# Altium project First_PCB_dip.PrjPcb
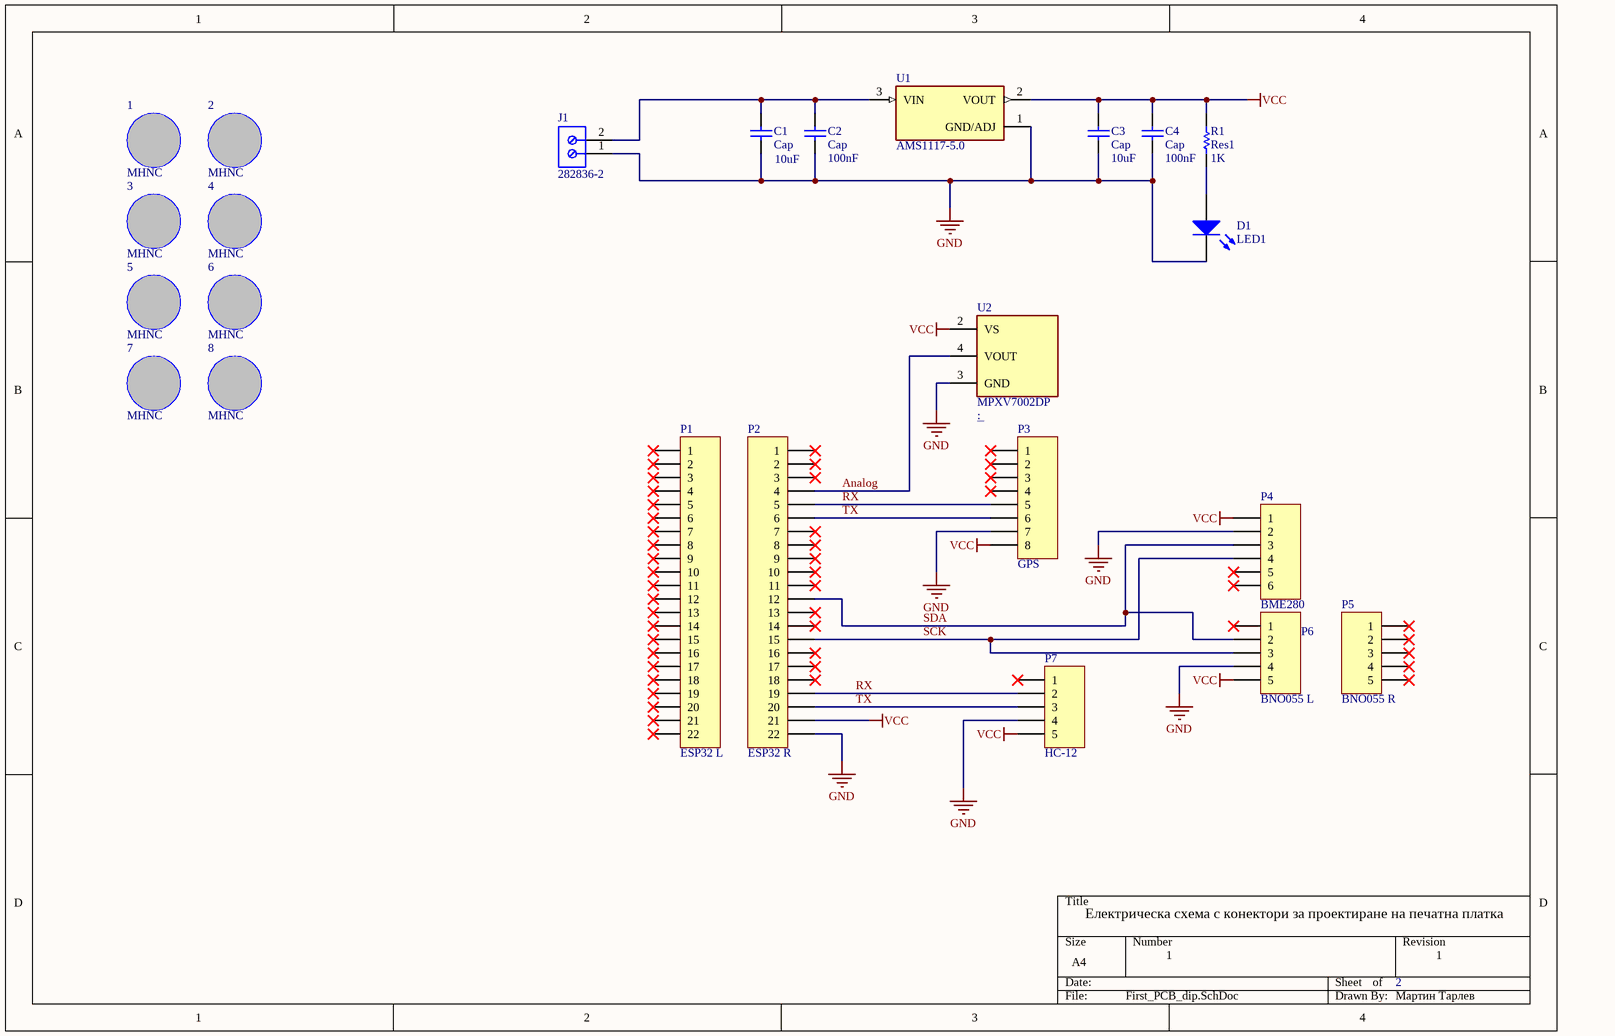
[diagram p0: First_PCB_dip.SchDoc]
2 sheets, 38 parts. Net scope: global (net labels, ports and power ports of the same name join across sheets).
Board file: First_PCB_dip.PcbDoc
Sheets:
  First_PCB_dip.SchDoc
  EL_SCH.SchDoc

## Sheet First_PCB_dip.SchDoc
size A4; SheetNumber: 1; SheetTotal: 2; SPICEModelCacheXDTSTVIX: <root> / <DocumentId>XDTSTVIX</DocumentId> / <CacheFrame Number="0"> / <Model Name="cap" Kind="MDL"> / <Text>*Default semiconductor capacitor / .MODEL CAP C()</Text> / </Model> / <Model Name="led1" Kind="MDL"> / <Text>*Typ RED GaAs LED: Vf=1.7V Vr=4V If=40mA trr=3uS / *LED Pinout: 1=A, 2=K / .MODEL LED1 D (IS=93.2P RS=42M N=3.73 BV=4 IBV=10U / + CJO=2.97P VJ=.75 M=.333 TT=4.32U)</Text> / </Model> / </CacheFrame> / </root>

### Parts
1  MHNC  [MHNC]
2  MHNC  [MHNC]
3  MHNC  [MHNC]
4  MHNC  [MHNC]
5  MHNC  [MHNC]
6  MHNC  [MHNC]
7  MHNC  [MHNC]
8  MHNC  [MHNC]
C1  Cap  value 10uF  [CAP2]
C2  Cap  value 100nF  [CON]
C3  Cap  value 10uF  [CAP2]
C4  Cap  value 100nF  [CON]
D1  LED1  [LED-1]
J1  282836-2  [TECO-282836-2_V]
P1  ESP32 L  [HDR1X22]
P2  ESP32 R  [HDR1X22]
P3  GPS  [HDR1X8]
P4  BME280  [HDR1X6]
P5  BNO055 R  [HDR1X5]
P6  BNO055 L  [HDR1X5]
P7  HC-12  [HDR1X5]
R1  Res1  value 1K  [AXIAL-0.3]
U1  AMS1117-5.0  [SOT229P700X180-4N]
U2  MPXV7002DP  [XDCR_MPXV7002DP]

### Nets
GND: C1.1 C2.1 C3.1 C4.1 D1.2(K) J1.1 P2.22 P3.7 P4.2 P6.4 P7.4 U1.1(GND/ADJ) U2.3(GND)
VCC: C3.2 C4.2 P2.21 P3.8 P4.1 P6.5 P7.5 R1.2 U1.2(VOUT) U2.2(VS)
Analog: P2.4 U2.4(VOUT)
RX: P2.5 P2.19 P3.5 P7.2
SCK: P2.15 P4.4 P6.3
SDA: P2.12 P4.3 P6.2
TX: P2.6 P2.20 P3.6 P7.3
NetC1_2: C1.2 C2.2 J1.2 U1.3(VIN)
NetD1_1: D1.1(A) R1.1

Not connected (* = marked no-connect by the designer): P1 1* 2* 3* 4* 5* 6* 7* 8* 9* 10* 11* 12* 13* 14* 15* 16* 17* 18* 19* 20* 21* 22*; P2 1* 2* 3* 7* 8* 9* 10* 11* 13* 14* 16* 17* 18*; P3 1* 2* 3* 4*; P4 5* 6*; P5 1* 2* 3* 4* 5*; P6 1*; P7 1*

### Notes on the sheet
- Електрическа схема с конектори за проектиране на печатна платка
- 1
- 2
- Мартин Тарлев

### Library data of the parts
C1-C4 = Cap: Capacitor; Published: 8-Jun-2000; LatestRevisionDate: 17-Jul-2002; LatestRevisionNote: Re-released for DXP Platform.; PackageReference: RAD-0.3; Publisher: Altium Limited; PackageDescription: Radial Cap, Thru-Hole; 2 Leads; 0.3 in Pin Spacing
D1 = LED1: Typical RED GaAs LED; Published: 8-Jun-2000; LatestRevisionDate: 08-Jul-2005; LatestRevisionNote: Mech Layer 1 removed.; PackageReference: LED-1; Publisher: Altium Limited; PackageDescription: LED; 2 Leads
J1 = CMP-1684-00017-1: Female Header, Pitch 5 mm, 1 x 2 Position, Height 10 mm, Tail Length 3.5 mm, Rohs, Bulk; Manufacturer: TE Connectivity; Wire Gauge: 16-30AWG; Product Training Modules: Wire-to-BoardEurostyleTerminalBlocks; Clamp Material - Plating: Brass-NickelPlated; Voltage: 300V; Mating Orientation: HorizontalwithBoard; Current: 13.5A; Pitch: 0.197"(5.00mm); Screw Thread: M3; 3D Model: 282836-2.pdf; Other Names: 5ULV-02B / A98076; Dynamic Catalog: BuchananSeries; Number of Levels: 1; Torque - Screw: 0.68Nm(6Lb-In); Featured Product: EurostyleTerminalBlockConnectors; Positions Per Level: 2; Wire Termination: Screw-RisingCageClamp; Datasheet URL: http://www.te.com.cn/commerce/DocumentDelivery/DDEController?Action=showdoc&DocId=Catalog+Section%7F1308389_EUROSTYLE_TERMINAL_BLOCKS%7F0607%7Fpdf%7FEnglish%7FENG_CS_1308389_EUROSTYLE_TERMINAL_BLOCKS_0607.pdf%7F282836-2; Color: Green; Family: TerminalBlocks-WiretoBoard; RoHS Information: 282836-2StatementofCompliance; Standard Package: 300; Contact Material - Plating: Brass-TinPlated; Manufacturer URL: http://www.te.com; Housing Material: Polyamide(PA66),Nylon6/6; Features: Interlocking(Side); Package Description: Female Header, Pitch 5 mm, 1 x 2 Position, Height 10 mm, Tail Length 3.5 mm; Mounting Type: ThroughHole; Package Reference: THD; Packaging: Bulk; Series: Buchanan; Category: Connectors,Interconnects; Screw Material - Plating: Brass-NickelPlated
P1 P2 = Header 22: Header, 22-Pin; LatestRevisionDate: 17-Jul-2002; LatestRevisionNote: Re-released for DXP Platform.
  P1: Publisher: p
  P2: Publisher: Altium Limited
P3 = Header 8: Header, 8-Pin; LatestRevisionDate: 17-Jul-2002; LatestRevisionNote: Re-released for DXP Platform.; Publisher: Altium Limited
P4 = Header 6: Header, 6-Pin; LatestRevisionDate: 17-Jul-2002; LatestRevisionNote: Re-released for DXP Platform.; Publisher: Altium Limited
P5-P7 = Header 5: Header, 5-Pin; LatestRevisionDate: 17-Jul-2002; LatestRevisionNote: Re-released for DXP Platform.; Publisher: Altium Limited
R1 = Res1: Resistor; Published: 8-Jun-2000; LatestRevisionDate: 17-Jul-2002; LatestRevisionNote: Re-released for DXP Platform.; PackageReference: AXIAL-0.3; Publisher: Altium Limited; PackageDescription: Axial Device, Thru-Hole; 2 Leads; 0.3 in Pin Spacing
U1 = AMS1117-5.0: 1A LOW DROPOUT VOLTAGE REGULATOR; MF: ams; MP: AMS1117-5.0; Package: SOT-223 Seeed Technology; SnapEDA_Link: https://www.snapeda.com/parts/AMS1117-5.0/ams/view-part/?ref=snap; Check_prices: https://www.snapeda.com/parts/AMS1117-5.0/ams/view-part/?ref=eda; Availability: Not in stock; Value: *; Price: None
U2 = MPXV7002DP: Pressure Sensor Â±0.29PSI (Â±2kPa) Differential Male - 0.13 (3.3mm) Tube, Dual 0.5 V ~ 4.5 V 8-BSOP (0.475, 12.06mm Width) Dual Ports, Same Side; MF: NXP USA; Availability: Unavailable; SnapEDA_Link: https://www.snapeda.com/parts/MPXV7002DP/NXP%20USA%20Inc./view-part/490173/?ref=snap; MP: MPXV7002DP; Price: None; Package: - NXP USA; Value: *

## Sheet EL_SCH.SchDoc
size A4; SheetNumber: 2; SheetTotal: 2; SPICEModelCacheLZFWWSBS: <root> / <DocumentId>LZFWWSBS</DocumentId> / <CacheFrame Number="0"> / <Model Name="cap" Kind="MDL"> / <Text>*Default semiconductor capacitor / .MODEL CAP C()</Text> / </Model> / <Model Name="led1" Kind="MDL"> / <Text>*Typ RED GaAs LED: Vf=1.7V Vr=4V If=40mA trr=3uS / *LED Pinout: 1=A, 2=K / .MODEL LED1 D (IS=93.2P RS=42M N=3.73 BV=4 IBV=10U / + CJO=2.97P VJ=.75 M=.333 TT=4.32U)</Text> / </Model> / </CacheFrame> / </root>
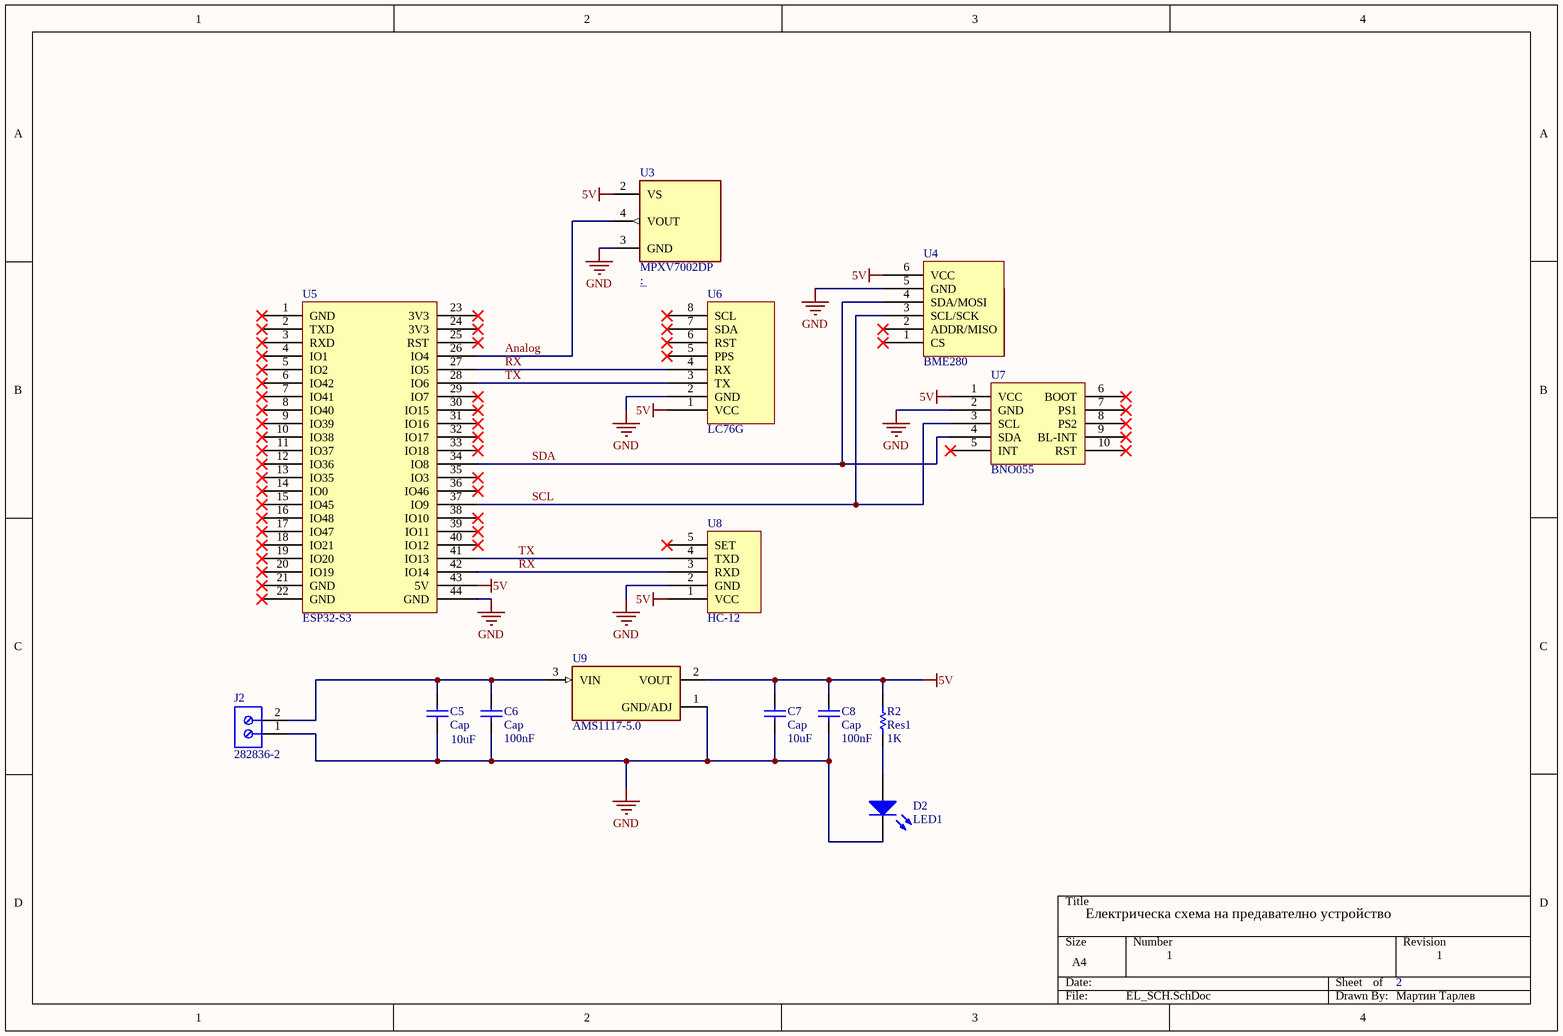
[diagram p1: EL_SCH.SchDoc]

### Parts
C5  Cap  value 10uF  [CAP2]
C6  Cap  value 100nF  [CON]
C7  Cap  value 10uF  [CAP2]
C8  Cap  value 100nF  [CON]
D2  LED1  [LED-1]
J2  282836-2  [TECO-282836-2_V]
R2  Res1  value 1K  [AXIAL-0.3]
U3  MPXV7002DP  [XDCR_MPXV7002DP]
U4  BME280
U5  ESP32-S3
U6  LC76G
U7  BNO055
U8  HC-12
U9  AMS1117-5.0  [SOT229P700X180-4N]

### Nets
5V: C7.2 C8.2 R2.2 U3.2(VS) U4.6(VCC) U5.43(5V) U6.1(VCC) U7.1(VCC) U8.1(VCC) U9.2(VOUT)
GND: C5.1 C6.1 C7.1 C8.1 D2.2(K) J2.1 U3.3(GND) U4.5(GND) U5.44(GND) U6.2(GND) U7.2(GND) U8.2(GND) U9.1(GND/ADJ)
Analog: U3.4(VOUT) U5.26(IO4)
RX: U5.27(IO5) U5.42(IO14) U6.4(RX) U8.3(RXD)
SCL: U4.3(SCL/SCK) U5.37(IO9) U7.3(SCL)
SDA: U4.4(SDA/MOSI) U5.34(IO8) U7.4(SDA)
TX: U5.28(IO6) U5.41(IO13) U6.3(TX) U8.4(TXD)
NetC5_2: C5.2 C6.2 J2.2 U9.3(VIN)
NetD2_1: D2.1(A) R2.1

Not connected (* = marked no-connect by the designer): U4 1(CS)* 2(ADDR/MISO)*; U5 1(GND)* 2(TXD)* 3(RXD)* 4(IO1)* 5(IO2)* 6(IO42)* 7(IO41)* 8(IO40)* 9(IO39)* 10(IO38)* 11(IO37)* 12(IO36)* 13(IO35)* 14(IO0)* 15(IO45)* 16(IO48)* 17(IO47)* 18(IO21)* 19(IO20)* 20(IO19)* 21(GND)* 22(GND)* 23(3V3)* 24(3V3)* 25(RST)* 29(IO7)* 30(IO15)* 31(IO16)* 32(IO17)* 33(IO18)* 35(IO3)* 36(IO46)* 38(IO10)* 39(IO11)* 40(IO12)*; U6 5(PPS)* 6(RST)* 7(SDA)* 8(SCL)*; U7 5(INT)* 6(BOOT)* 7(PS1)* 8(PS2)* 9(BL-INT)* 10(RST)*; U8 5(SET)*

### Notes on the sheet
- Електрическа схема на предавателно устройство
- 1
- 2
- Мартин Тарлев

### Library data of the parts
C5-C8 = Cap: Capacitor; Published: 8-Jun-2000; LatestRevisionDate: 17-Jul-2002; LatestRevisionNote: Re-released for DXP Platform.; PackageReference: RAD-0.3; Publisher: Altium Limited; PackageDescription: Radial Cap, Thru-Hole; 2 Leads; 0.3 in Pin Spacing
D2 = LED1: Typical RED GaAs LED; Published: 8-Jun-2000; LatestRevisionDate: 08-Jul-2005; LatestRevisionNote: Mech Layer 1 removed.; PackageReference: LED-1; Publisher: Altium Limited; PackageDescription: LED; 2 Leads
J2 = CMP-1684-00017-1: as J1 on sheet First_PCB_dip; Datasheet URL: http://www.te.com.cn/commerce/DocumentDelivery/DDEController?Action=showdoc&DocId=Catalog+Section%7F1308389_EUROSTYLE_TERMINAL_BLOCKS%7F0607%7Fpdf%7FEnglish%7FENG_CS_1308389_EUROSTYLE_TERMINAL_BLOCKS_0607.pdf%7F282836-2; Color: Green; Family: TerminalBlocks-WiretoBoard; RoHS Information: 282836-2StatementofCompliance; Standard Package: 300; Contact Material - Plating: Brass-TinPlated; Manufacturer URL: http://www.te.com; Housing Material: Polyamide(PA66),Nylon6/6; Features: Interlocking(Side); Package Description: Female Header, Pitch 5 mm, 1 x 2 Position, Height 10 mm, Tail Length 3.5 mm; Mounting Type: ThroughHole; Package Reference: THD; Packaging: Bulk; Series: Buchanan; Category: Connectors,Interconnects; Screw Material - Plating: Brass-NickelPlated
R2 = Res1: Resistor; Published: 8-Jun-2000; LatestRevisionDate: 17-Jul-2002; LatestRevisionNote: Re-released for DXP Platform.; PackageReference: AXIAL-0.3; Publisher: Altium Limited; PackageDescription: Axial Device, Thru-Hole; 2 Leads; 0.3 in Pin Spacing
U3 = MPXV7002DP: as U2 on sheet First_PCB_dip; Availability: Unavailable; SnapEDA_Link: https://www.snapeda.com/parts/MPXV7002DP/NXP%20USA%20Inc./view-part/490173/?ref=snap; MP: MPXV7002DP; Price: None; Package: - NXP USA; Value: *
U9 = AMS1117-5.0: as U1 on sheet First_PCB_dip; MP: AMS1117-5.0; Package: SOT-223 Seeed Technology; SnapEDA_Link: https://www.snapeda.com/parts/AMS1117-5.0/ams/view-part/?ref=snap; Check_prices: https://www.snapeda.com/parts/AMS1117-5.0/ams/view-part/?ref=eda; Availability: Not in stock; Value: *; Price: None

## Nets that join several sheets
GND: First_PCB_dip (13 pins), EL_SCH (13 pins)
Analog: First_PCB_dip (P2.4 U2.4), EL_SCH (U3.4 U5.26)
RX: First_PCB_dip (P2.5 P2.19 P3.5 P7.2), EL_SCH (U5.27 U5.42 U6.4 U8.3)
SDA: First_PCB_dip (P2.12 P4.3 P6.2), EL_SCH (U4.4 U5.34 U7.4)
TX: First_PCB_dip (P2.6 P2.20 P3.6 P7.3), EL_SCH (U5.28 U5.41 U6.3 U8.4)